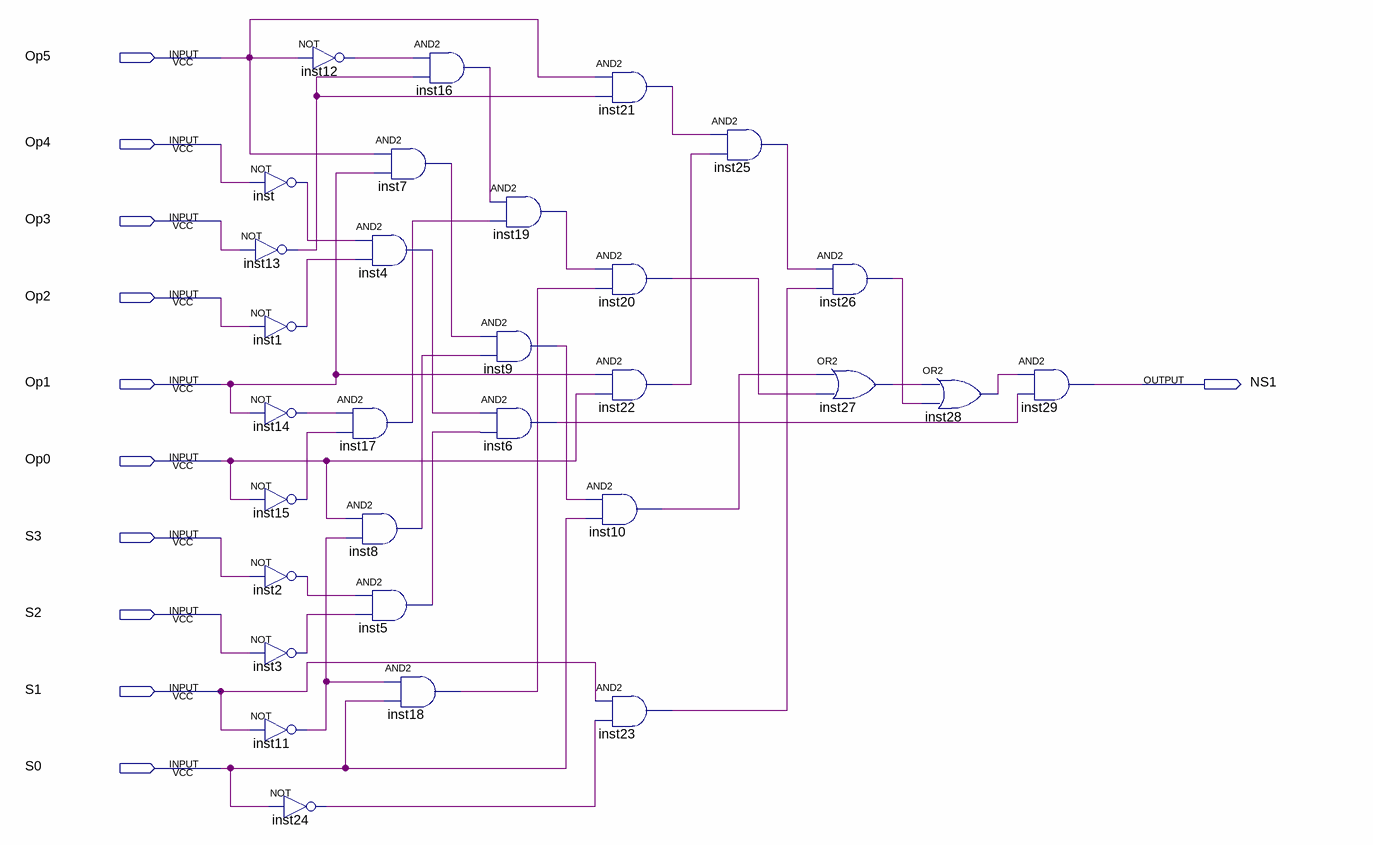
[diagram p0: schematic sheet]
// Quartus schematic NS1.bdf as structural Verilog: 30 symbols, 11 pins
module NS1 (
  input  Op5,
  input  Op4,
  input  Op3,
  input  Op2,
  input  Op1,
  input  Op0,
  input  S3,
  input  S2,
  input  S1,
  input  S0,
  output NS1
);

  wire inst1_out, inst2_out, inst3_out, inst4_out, inst5_out, inst6_out, inst7_out, inst8_out, inst9_out,
       inst10_out, inst11_out, inst12_out, inst13_out, inst14_out, inst15_out, inst16_out, inst17_out,
       inst18_out, inst19_out, inst20_out, inst21_out, inst22_out, inst23_out, inst24_out, inst25_out,
       inst26_out, inst27_out, inst28_out, inst_out;

  not inst12 (inst12_out, Op5);
  not inst (inst_out, Op4);
  not inst13 (inst13_out, Op3);
  not inst1 (inst1_out, Op2);
  not inst14 (inst14_out, Op1);
  not inst15 (inst15_out, Op0);
  not inst2 (inst2_out, S3);
  not inst3 (inst3_out, S2);
  not inst11 (inst11_out, S1);
  not inst24 (inst24_out, S0);
  and inst7 (inst7_out, Op5, Op1);
  and inst4 (inst4_out, inst_out, inst1_out);
  and inst17 (inst17_out, inst14_out, inst15_out);
  and inst8 (inst8_out, Op0, inst11_out);
  and inst5 (inst5_out, inst2_out, inst3_out);
  and inst16 (inst16_out, inst12_out, inst13_out);
  and inst18 (inst18_out, inst11_out, S0);
  and inst19 (inst19_out, inst16_out, inst17_out);
  and inst9 (inst9_out, inst7_out, inst8_out);
  and inst6 (inst6_out, inst4_out, inst5_out);
  and inst21 (inst21_out, Op5, inst13_out);
  and inst20 (inst20_out, inst19_out, inst18_out);
  and inst22 (inst22_out, Op1, Op0);
  and inst10 (inst10_out, inst9_out, S0);
  and inst23 (inst23_out, S1, inst24_out);
  and inst25 (inst25_out, inst21_out, inst22_out);
  and inst26 (inst26_out, inst25_out, inst23_out);
  or inst27 (inst27_out, inst10_out, inst20_out);
  or inst28 (inst28_out, inst27_out, inst26_out);
  and inst29 (NS1, inst28_out, inst6_out);
endmodule
